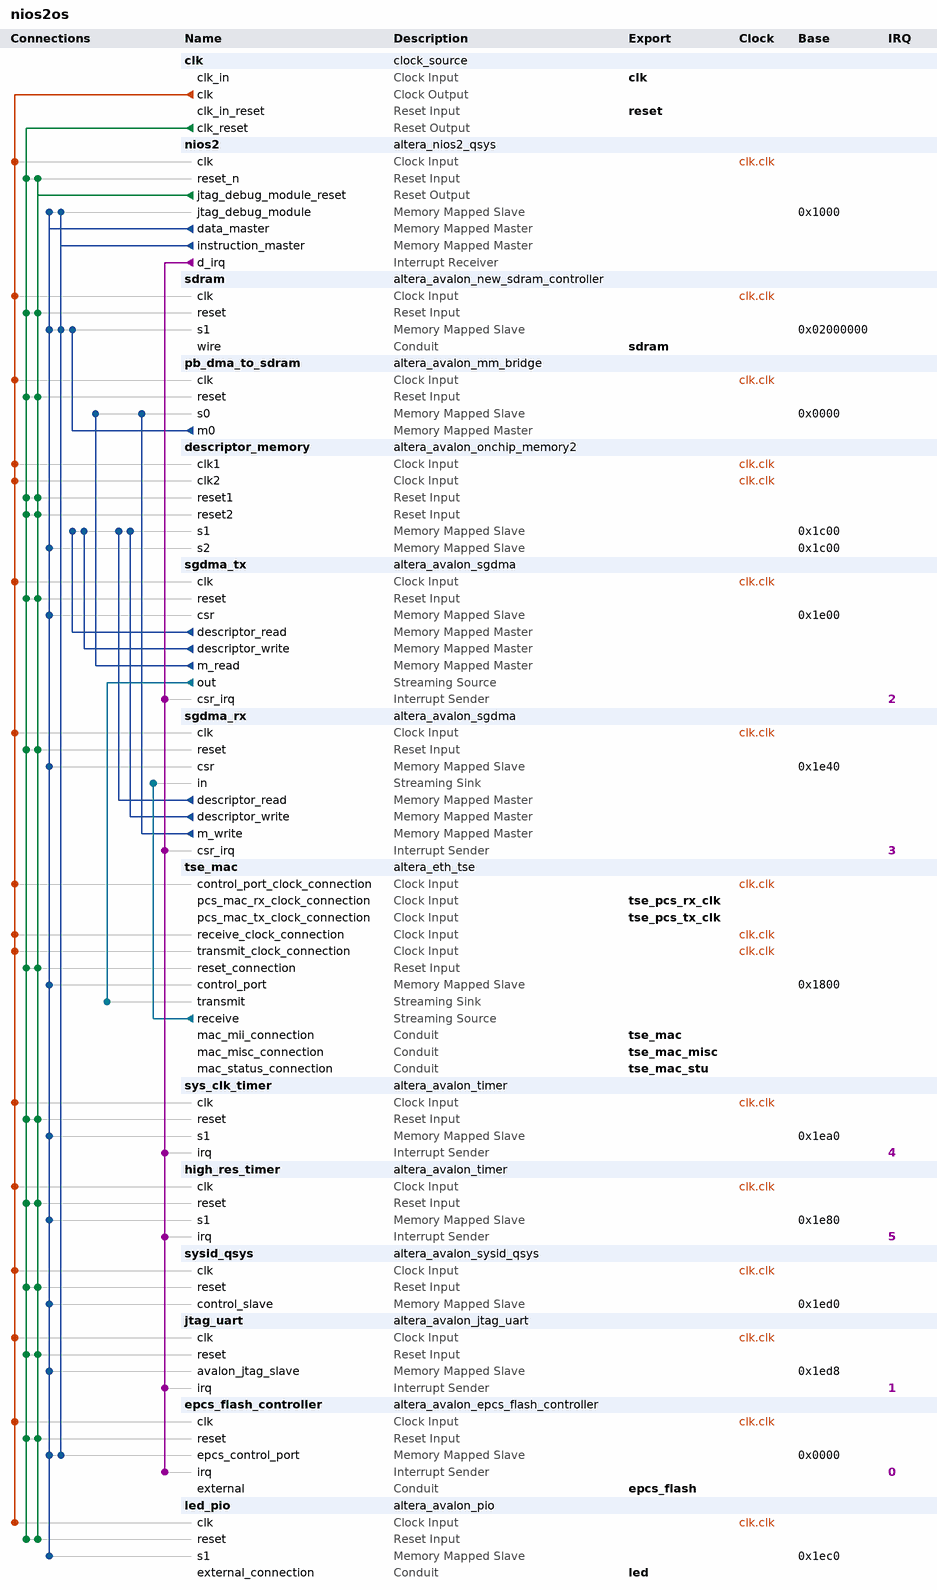
[diagram p0: system contents]
# Platform Designer (Qsys) system nios2os, Cyclone IV E EP4CE10F17C8
# Parameters at their usual value, and those the tool derives, are not listed.
package require -exact qsys 13.1
create_system nios2os
set_project_property DEVICE_FAMILY {Cyclone IV E}
set_project_property DEVICE EP4CE10F17C8

add_instance clk clock_source 13.1
set_instance_parameter_value clk clockFrequency 100000000

add_instance nios2 altera_nios2_qsys 13.1
set_instance_parameter_value nios2 muldiv_divider true
set_instance_parameter_value nios2 resetSlave epcs_flash_controller.epcs_control_port
set_instance_parameter_value nios2 mmu_TLBMissExcSlave None
set_instance_parameter_value nios2 exceptionSlave sdram.s1
set_instance_parameter_value nios2 breakSlave nios2.jtag_debug_module
set_instance_parameter_value nios2 impl Fast
set_instance_parameter_value nios2 icache_size 4096

add_instance sdram altera_avalon_new_sdram_controller 13.1
set_instance_parameter_value sdram TAC 5.4
set_instance_parameter_value sdram TRCD 20.0
set_instance_parameter_value sdram TRFC 64.0
set_instance_parameter_value sdram TRP 20.0
set_instance_parameter_value sdram TWR 20.0
set_instance_parameter_value sdram casLatency 3
set_instance_parameter_value sdram columnWidth 9
set_instance_parameter_value sdram dataWidth 16
set_instance_parameter_value sdram generateSimulationModel false
set_instance_parameter_value sdram initRefreshCommands 8
set_instance_parameter_value sdram model single_Micron_MT48LC4M32B2_7_chip
set_instance_parameter_value sdram numberOfBanks 4
set_instance_parameter_value sdram numberOfChipSelects 1
set_instance_parameter_value sdram powerUpDelay 200.0
set_instance_parameter_value sdram refreshPeriod 7.8125
set_instance_parameter_value sdram rowWidth 13

add_instance pb_dma_to_sdram altera_avalon_mm_bridge 13.1
set_instance_parameter_value pb_dma_to_sdram DATA_WIDTH 32
set_instance_parameter_value pb_dma_to_sdram ADDRESS_WIDTH 27
set_instance_parameter_value pb_dma_to_sdram ADDRESS_UNITS SYMBOLS
set_instance_parameter_value pb_dma_to_sdram MAX_PENDING_RESPONSES 34

add_instance descriptor_memory altera_avalon_onchip_memory2 13.1
set_instance_parameter_value descriptor_memory dataWidth 32
set_instance_parameter_value descriptor_memory dualPort true
set_instance_parameter_value descriptor_memory initMemContent true
set_instance_parameter_value descriptor_memory initializationFileName onchip_mem.hex
set_instance_parameter_value descriptor_memory memorySize 512

add_instance sgdma_tx altera_avalon_sgdma 13.1
set_instance_parameter_value sgdma_tx enableBurstTransfers false
set_instance_parameter_value sgdma_tx enableUnalignedTransfers false
set_instance_parameter_value sgdma_tx readBlockDataWidth 32
set_instance_parameter_value sgdma_tx sinkErrorWidth 0
set_instance_parameter_value sgdma_tx sourceErrorWidth 1
set_instance_parameter_value sgdma_tx transferMode MEMORY_TO_STREAM
set_instance_parameter_value sgdma_tx writeBurstcountWidth 4

add_instance sgdma_rx altera_avalon_sgdma 13.1
set_instance_parameter_value sgdma_rx enableBurstTransfers false
set_instance_parameter_value sgdma_rx enableUnalignedTransfers false
set_instance_parameter_value sgdma_rx readBlockDataWidth 32
set_instance_parameter_value sgdma_rx sinkErrorWidth 6
set_instance_parameter_value sgdma_rx sourceErrorWidth 0
set_instance_parameter_value sgdma_rx transferMode STREAM_TO_MEMORY
set_instance_parameter_value sgdma_rx writeBurstcountWidth 4

add_instance tse_mac altera_eth_tse 13.1
set_instance_parameter_value tse_mac core_variation SMALL_MAC_10_100
set_instance_parameter_value tse_mac ifGMII MII
set_instance_parameter_value tse_mac transceiver_type NONE
set_instance_parameter_value tse_mac enable_hd_logic true
set_instance_parameter_value tse_mac stat_cnt_ena false
set_instance_parameter_value tse_mac enable_shift16 true
set_instance_parameter_value tse_mac enable_mac_flow_ctrl false
set_instance_parameter_value tse_mac enable_magic_detect false
set_instance_parameter_value tse_mac useMDIO false
set_instance_parameter_value tse_mac mdio_clk_div 40
set_instance_parameter_value tse_mac eg_addr 9
set_instance_parameter_value tse_mac ing_addr 9

add_instance sys_clk_timer altera_avalon_timer 13.1
set_instance_parameter_value sys_clk_timer fixedPeriod true
set_instance_parameter_value sys_clk_timer period 10
set_instance_parameter_value sys_clk_timer periodUnits MSEC

add_instance high_res_timer altera_avalon_timer 13.1
set_instance_parameter_value high_res_timer fixedPeriod true
set_instance_parameter_value high_res_timer period 10
set_instance_parameter_value high_res_timer periodUnits USEC

add_instance sysid_qsys altera_avalon_sysid_qsys 13.1
set_instance_parameter_value sysid_qsys id 2

add_instance jtag_uart altera_avalon_jtag_uart 13.1
set_instance_parameter_value jtag_uart simInteractiveOptions NO_INTERACTIVE_WINDOWS

add_instance epcs_flash_controller altera_avalon_epcs_flash_controller 13.1
set_instance_parameter_value epcs_flash_controller autoSelectASMIAtom false

add_instance led_pio altera_avalon_pio 13.1
set_instance_parameter_value led_pio direction Output
set_instance_parameter_value led_pio width 4

# connections
add_connection clk.clk descriptor_memory.clk1 clock
add_connection clk.clk descriptor_memory.clk2 clock
add_connection clk.clk epcs_flash_controller.clk clock
add_connection clk.clk high_res_timer.clk clock
add_connection clk.clk jtag_uart.clk clock
add_connection clk.clk led_pio.clk clock
add_connection clk.clk nios2.clk clock
add_connection clk.clk pb_dma_to_sdram.clk clock
add_connection clk.clk sdram.clk clock
add_connection clk.clk sgdma_rx.clk clock
add_connection clk.clk sgdma_tx.clk clock
add_connection clk.clk sys_clk_timer.clk clock
add_connection clk.clk sysid_qsys.clk clock
add_connection clk.clk tse_mac.control_port_clock_connection clock
add_connection clk.clk tse_mac.receive_clock_connection clock
add_connection clk.clk tse_mac.transmit_clock_connection clock
add_connection clk.clk_reset descriptor_memory.reset1 reset
add_connection clk.clk_reset descriptor_memory.reset2 reset
add_connection clk.clk_reset epcs_flash_controller.reset reset
add_connection clk.clk_reset high_res_timer.reset reset
add_connection clk.clk_reset jtag_uart.reset reset
add_connection clk.clk_reset led_pio.reset reset
add_connection clk.clk_reset nios2.reset_n reset
add_connection clk.clk_reset pb_dma_to_sdram.reset reset
add_connection clk.clk_reset sdram.reset reset
add_connection clk.clk_reset sgdma_rx.reset reset
add_connection clk.clk_reset sgdma_tx.reset reset
add_connection clk.clk_reset sys_clk_timer.reset reset
add_connection clk.clk_reset sysid_qsys.reset reset
add_connection clk.clk_reset tse_mac.reset_connection reset
add_connection nios2.jtag_debug_module_reset descriptor_memory.reset1 reset
add_connection nios2.jtag_debug_module_reset descriptor_memory.reset2 reset
add_connection nios2.jtag_debug_module_reset epcs_flash_controller.reset reset
add_connection nios2.jtag_debug_module_reset high_res_timer.reset reset
add_connection nios2.jtag_debug_module_reset jtag_uart.reset reset
add_connection nios2.jtag_debug_module_reset led_pio.reset reset
add_connection nios2.jtag_debug_module_reset nios2.reset_n reset
add_connection nios2.jtag_debug_module_reset pb_dma_to_sdram.reset reset
add_connection nios2.jtag_debug_module_reset sdram.reset reset
add_connection nios2.jtag_debug_module_reset sgdma_rx.reset reset
add_connection nios2.jtag_debug_module_reset sgdma_tx.reset reset
add_connection nios2.jtag_debug_module_reset sys_clk_timer.reset reset
add_connection nios2.jtag_debug_module_reset sysid_qsys.reset reset
add_connection nios2.jtag_debug_module_reset tse_mac.reset_connection reset
add_connection nios2.data_master descriptor_memory.s2 avalon
set_connection_parameter_value nios2.data_master/descriptor_memory.s2 baseAddress 0x1c00
add_connection nios2.data_master epcs_flash_controller.epcs_control_port avalon
set_connection_parameter_value nios2.data_master/epcs_flash_controller.epcs_control_port baseAddress 0x0000
add_connection nios2.data_master high_res_timer.s1 avalon
set_connection_parameter_value nios2.data_master/high_res_timer.s1 baseAddress 0x1e80
add_connection nios2.data_master jtag_uart.avalon_jtag_slave avalon
set_connection_parameter_value nios2.data_master/jtag_uart.avalon_jtag_slave baseAddress 0x1ed8
add_connection nios2.data_master led_pio.s1 avalon
set_connection_parameter_value nios2.data_master/led_pio.s1 baseAddress 0x1ec0
add_connection nios2.data_master nios2.jtag_debug_module avalon
set_connection_parameter_value nios2.data_master/nios2.jtag_debug_module baseAddress 0x1000
add_connection nios2.data_master sdram.s1 avalon
set_connection_parameter_value nios2.data_master/sdram.s1 baseAddress 0x02000000
add_connection nios2.data_master sgdma_rx.csr avalon
set_connection_parameter_value nios2.data_master/sgdma_rx.csr baseAddress 0x1e40
add_connection nios2.data_master sgdma_tx.csr avalon
set_connection_parameter_value nios2.data_master/sgdma_tx.csr baseAddress 0x1e00
add_connection nios2.data_master sys_clk_timer.s1 avalon
set_connection_parameter_value nios2.data_master/sys_clk_timer.s1 baseAddress 0x1ea0
add_connection nios2.data_master sysid_qsys.control_slave avalon
set_connection_parameter_value nios2.data_master/sysid_qsys.control_slave baseAddress 0x1ed0
add_connection nios2.data_master tse_mac.control_port avalon
set_connection_parameter_value nios2.data_master/tse_mac.control_port baseAddress 0x1800
add_connection nios2.instruction_master epcs_flash_controller.epcs_control_port avalon
set_connection_parameter_value nios2.instruction_master/epcs_flash_controller.epcs_control_port baseAddress 0x0000
add_connection nios2.instruction_master nios2.jtag_debug_module avalon
set_connection_parameter_value nios2.instruction_master/nios2.jtag_debug_module baseAddress 0x1000
add_connection nios2.instruction_master sdram.s1 avalon
set_connection_parameter_value nios2.instruction_master/sdram.s1 baseAddress 0x02000000
add_connection pb_dma_to_sdram.m0 sdram.s1 avalon
set_connection_parameter_value pb_dma_to_sdram.m0/sdram.s1 baseAddress 0x02000000
add_connection sgdma_rx.descriptor_read descriptor_memory.s1 avalon
set_connection_parameter_value sgdma_rx.descriptor_read/descriptor_memory.s1 baseAddress 0x1c00
add_connection sgdma_rx.descriptor_write descriptor_memory.s1 avalon
set_connection_parameter_value sgdma_rx.descriptor_write/descriptor_memory.s1 baseAddress 0x1c00
add_connection sgdma_rx.m_write pb_dma_to_sdram.s0 avalon
set_connection_parameter_value sgdma_rx.m_write/pb_dma_to_sdram.s0 baseAddress 0x0000
add_connection sgdma_tx.descriptor_read descriptor_memory.s1 avalon
set_connection_parameter_value sgdma_tx.descriptor_read/descriptor_memory.s1 baseAddress 0x1c00
add_connection sgdma_tx.descriptor_write descriptor_memory.s1 avalon
set_connection_parameter_value sgdma_tx.descriptor_write/descriptor_memory.s1 baseAddress 0x1c00
add_connection sgdma_tx.m_read pb_dma_to_sdram.s0 avalon
set_connection_parameter_value sgdma_tx.m_read/pb_dma_to_sdram.s0 baseAddress 0x0000
add_connection sgdma_tx.out tse_mac.transmit avalon_streaming
add_connection tse_mac.receive sgdma_rx.in avalon_streaming
add_connection nios2.d_irq epcs_flash_controller.irq interrupt
set_connection_parameter_value nios2.d_irq/epcs_flash_controller.irq irqNumber 0
add_connection nios2.d_irq high_res_timer.irq interrupt
set_connection_parameter_value nios2.d_irq/high_res_timer.irq irqNumber 5
add_connection nios2.d_irq jtag_uart.irq interrupt
set_connection_parameter_value nios2.d_irq/jtag_uart.irq irqNumber 1
add_connection nios2.d_irq sgdma_rx.csr_irq interrupt
set_connection_parameter_value nios2.d_irq/sgdma_rx.csr_irq irqNumber 3
add_connection nios2.d_irq sgdma_tx.csr_irq interrupt
set_connection_parameter_value nios2.d_irq/sgdma_tx.csr_irq irqNumber 2
add_connection nios2.d_irq sys_clk_timer.irq interrupt
set_connection_parameter_value nios2.d_irq/sys_clk_timer.irq irqNumber 4

# exported interfaces
add_interface clk clock sink
set_interface_property clk EXPORT_OF clk.clk_in
add_interface reset reset sink
set_interface_property reset EXPORT_OF clk.clk_in_reset
add_interface sdram conduit end
set_interface_property sdram EXPORT_OF sdram.wire
add_interface epcs_flash conduit end
set_interface_property epcs_flash EXPORT_OF epcs_flash_controller.external
add_interface tse_pcs_tx_clk clock sink
set_interface_property tse_pcs_tx_clk EXPORT_OF tse_mac.pcs_mac_tx_clock_connection
add_interface tse_pcs_rx_clk clock sink
set_interface_property tse_pcs_rx_clk EXPORT_OF tse_mac.pcs_mac_rx_clock_connection
add_interface tse_mac_stu conduit end
set_interface_property tse_mac_stu EXPORT_OF tse_mac.mac_status_connection
add_interface tse_mac conduit end
set_interface_property tse_mac EXPORT_OF tse_mac.mac_mii_connection
add_interface tse_mac_misc conduit end
set_interface_property tse_mac_misc EXPORT_OF tse_mac.mac_misc_connection
add_interface led conduit end
set_interface_property led EXPORT_OF led_pio.external_connection

set_interconnect_requirement {$system} qsys_mm.clockCrossingAdapter HANDSHAKE
set_interconnect_requirement {$system} qsys_mm.maxAdditionalLatency 1
set_interconnect_requirement {$system} qsys_mm.insertDefaultSlave false

save_system nios2os.qsys
